# Altium schematic sheet Embedded_Circuits.SchDoc
size A
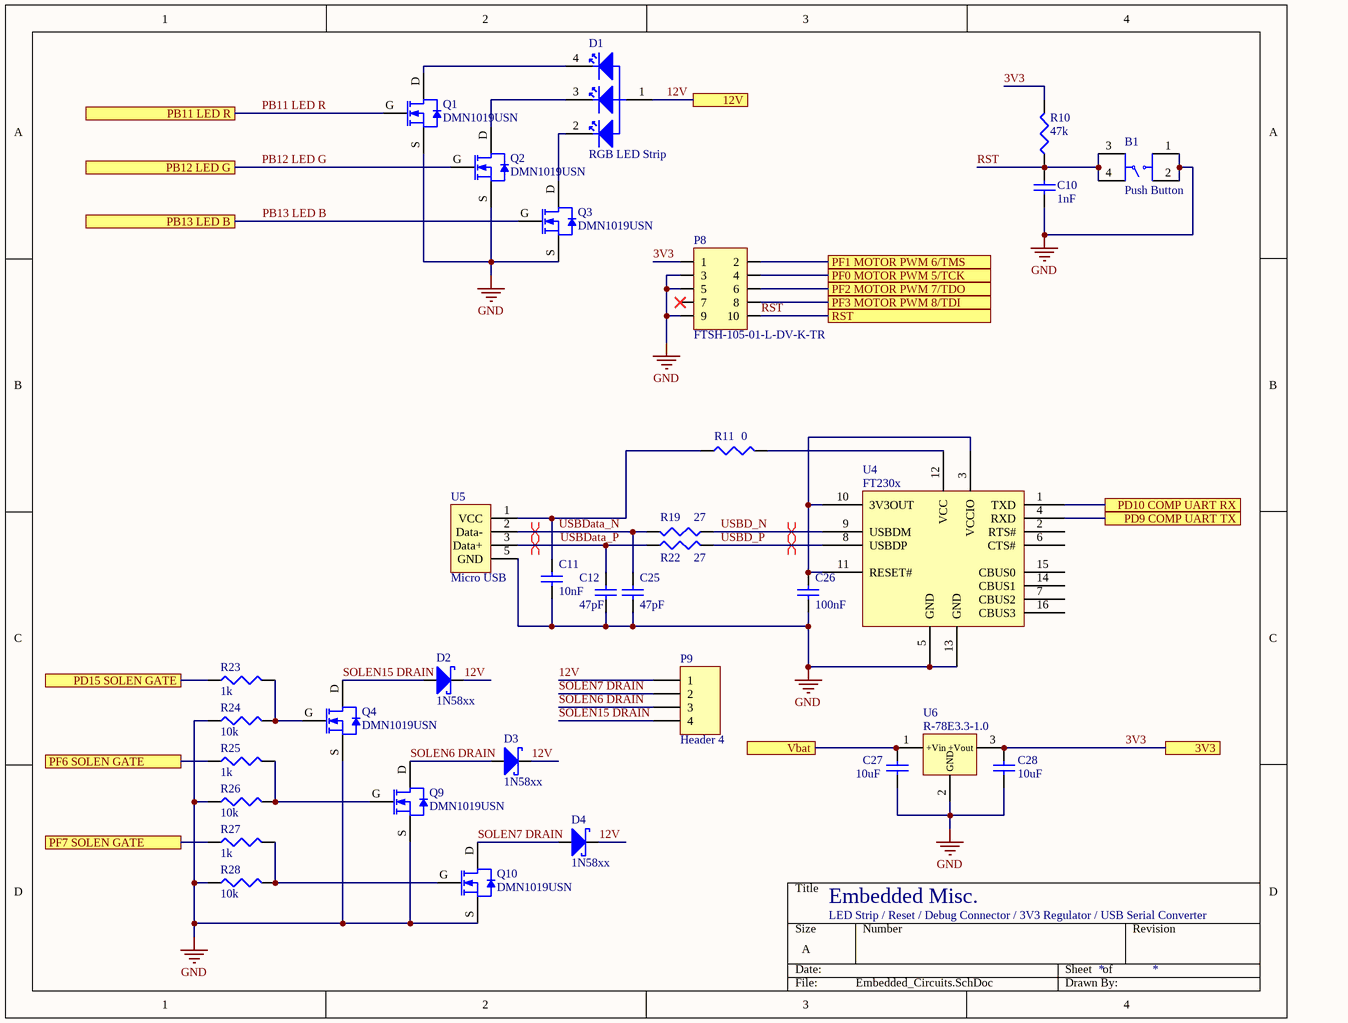
[diagram p0: Embedded_Circuits.SchDoc]

## Parts
B1  Push Button  [Push Button]
C10  value 1nF  [C1206]  (hidden comment: Cap Semi)
C11  value 10nF  [C1206]  (hidden comment: Cap)
C12  value 47pF  [C1206]  (hidden comment: Cap)
C25  value 47pF  [C1206]  (hidden comment: Cap)
C26  value 100nF  [C1206]  (hidden comment: Cap)
C27  value 10uF  [C1206]  (hidden comment: Cap)
C28  value 10uF  [C1206]  (hidden comment: Cap)
D1  RGB LED Strip  [Header 1x4]
D2  1N58xx  [1N58xx]
D3  1N58xx  [1N58xx]
D4  1N58xx  [1N58xx]
P8  FTSH-105-01-L-DV-K-TR  [FTSH-105-01-L-DV-K-TR]
P9  Header 4  [HDR1X4]
Q1  DMN1019USN  [SOT-23]
Q2  DMN1019USN  [SOT-23]
Q3  DMN1019USN  [SOT-23]
Q4  DMN1019USN  [SOT-23]
Q9  DMN1019USN  [SOT-23]
Q10  DMN1019USN  [SOT-23]
R10  value 47k  [J1-0603]  (hidden comment: Res3)
R11  value 0  [J1-0603]  (hidden comment: Res3)
R19  value 27  [J1-0603]  (hidden comment: Res3)
R22  value 27  [J1-0603]  (hidden comment: Res3)
R23  value 1k  [J1-0603]  (hidden comment: Res3)
R24  value 10k  [J1-0603]  (hidden comment: Res3)
R25  value 1k  [J1-0603]  (hidden comment: Res3)
R26  value 10k  [J1-0603]  (hidden comment: Res3)
R27  value 1k  [J1-0603]  (hidden comment: Res3)
R28  value 10k  [J1-0603]  (hidden comment: Res3)
U4  FT230x  [FT230X]
U5  Micro USB  [Micro USB]
U6  R-78E3.3-1.0  [R-78Exx-1.0]

## Ports
3V3, 12V, PB11 LED R, PB12 LED G, PB13 LED B, PD9 COMP UART TX, PD10 COMP UART RX, PD15 SOLEN GATE, PF0 MOTOR PWM 5/TCK, PF1 MOTOR PWM 6/TMS, PF2 MOTOR PWM 7/TDO, PF3 MOTOR PWM 8/TDI, PF6 SOLEN GATE, PF7 SOLEN GATE, RST, Vbat

## Nets
GND: B1.1 B1.2 C10.1 C11.1 C12.1 C25.1 C26.1 C27.1 C28.1 P8.3 P8.5 P8.9 Q1.S Q2.S Q3.S Q4.S Q9.S Q10.S R24.1 R26.1 R28.1 U4.5(GND) U4.13(GND) U5.5(GND) U6.2(GND)
3V3: C28.2 P8.1 R10.2 U6.3(+Vout) ; port 3V3
12V: D1.1 D2.K(Cathode) D3.K(Cathode) D4.K(Cathode) P9.1 ; port 12V
PB11 LED R: Q1.G ; port PB11 LED R
PB12 LED G: Q2.G ; port PB12 LED G
PB13 LED B: Q3.G ; port PB13 LED B
PD9 COMP UART TX: U4.4(RXD) ; port PD9 COMP UART TX
PD10 COMP UART RX: U4.1(TXD) ; port PD10 COMP UART RX
PD15 SOLEN GATE: R23.1 ; port PD15 SOLEN GATE
PF0 MOTOR PWM 5/TCK: P8.4 ; port PF0 MOTOR PWM 5/TCK
PF1 MOTOR PWM 6/TMS: P8.2 ; port PF1 MOTOR PWM 6/TMS
PF2 MOTOR PWM 7/TDO: P8.6 ; port PF2 MOTOR PWM 7/TDO
PF3 MOTOR PWM 8/TDI: P8.8 ; port PF3 MOTOR PWM 8/TDI
PF6 SOLEN GATE: R25.1 ; port PF6 SOLEN GATE
PF7 SOLEN GATE: R27.1 ; port PF7 SOLEN GATE
RST: B1.3 B1.4 C10.2 P8.10 R10.1 ; port RST
SOLEN6 DRAIN: D3.A(Anode) P9.3 Q9.D
SOLEN7 DRAIN: D4.A(Anode) P9.2 Q10.D
SOLEN15 DRAIN: D2.A(Anode) P9.4 Q4.D
USBD_N: R19.1 U4.9(USBDM)
USBD_P: R22.2 U4.8(USBDP)
USBData_N: C25.2 R19.2 U5.2(Data-)
USBData_P: C12.2 R22.1 U5.3(Data+)
Vbat: C27.2 U6.1(+Vin) ; port Vbat
NetC11_2: C11.2 R11.1 U5.1(VCC)
NetC26_2: C26.2 U4.3(VCCIO) U4.10(3V3OUT) U4.11(RESET#)
NetD1_2: D1.2 Q3.D
NetD1_3: D1.3 Q2.D
NetD1_4: D1.4 Q1.D
NetQ4_G: Q4.G R23.2 R24.2
NetQ9_G: Q9.G R25.2 R26.2
NetQ10_G: Q10.G R27.2 R28.2
NetR11_2: R11.2 U4.12(VCC)

Not connected (* = marked no-connect by the designer): P8 7*; U4 2(RTS#) 6(CTS#) 7(CBUS2) 14(CBUS1) 15(CBUS0) 16(CBUS3)

## Layout directives
differential pair: USBD_N, USBD_P, USBData_N, USBData_P

## Notes on the sheet
- Embedded Misc.
- LED Strip / Reset / Debug Connector / 3V3 Regulator / USB Serial Converter

## Library data of the parts
B1 = Push Button: Tactile Switch SPST-NO Top Actuated Through Hole; Digikey Link: https://www.digikey.com/product-detail/en/te-connectivity-alcoswitch-switches/FSM101/450-1157-ND/701084; Drawing: https://www.te.com/commerce/DocumentDelivery/DDEController?Action=srchrtrv&DocNm=1571140&DocType=Customer+Drawing&DocLang=English
C10 = Cap Semi: Capacitor (Semiconductor SIM Model); Published: 8-Jun-2000; LatestRevisionDate: 29-May-2009; LatestRevisionNote: IPC-7351 Footprint Added.; PackageReference: C1206; Publisher: Altium Limited; PackageDescription: Chip Capacitor; Supplier 1: Digi-Key; Supplier Part Number 1: 490-4761-1-ND
C11 C12 C25-C28 = Cap: Capacitor; Published: 8-Jun-2000; LatestRevisionDate: 17-Jul-2002; LatestRevisionNote: Re-released for DXP Platform.; PackageReference: RAD-0.3; Publisher: Altium Limited; PackageDescription: Radial Cap, Thru-Hole; 2 Leads; 0.3 in Pin Spacing; Supplier 1: Digi-Key
  C11: Supplier Part Number 1: 1276-1921-1-ND
  C12 C25: Supplier Part Number 1: 490-16375-1-ND
  C26: Supplier Part Number 1: 1276-1001-1-ND
  C27 C28: Supplier Part Number 1: 1276-2872-1-ND
D1 = RGB LED Strip: LED RGB Strip - Bare Nonaddressable; Sparkfun Link: https://www.sparkfun.com/products/12021
D2-D4 = 1N58xx: 1A Schottky Barrier Rectifier Diode; Datasheet: http://www.kesenes.com/pdf/1n5817-1n5819.pdf; Digikey: https://www.digikey.com/product-detail/en/comchip-technology/SS24-HF/641-SS24-HFCT-ND/10443817
P8 = JTAG Header: CONN HEADER 10POS DUAL .05" SMD; Digikey Link: https://www.digikey.com/product-detail/en/samtec-inc/FTSH-105-01-L-DV-K-TR/SAM13165CT-ND/8827920; Drawings: http://suddendocs.samtec.com/prints/ftsh-1xx-xx-xxx-dv-xxx-xxx-mkt.pdf; Datasheet: http://suddendocs.samtec.com/catalog_english/ftsh_smt.pdf
P9 = Header 4: Header, 4-Pin; LatestRevisionDate: 17-Jul-2002; LatestRevisionNote: Re-released for DXP Platform.; Publisher: Altium Limited
Q1-Q4 Q9 Q10 = DMN1019USN: 12V N-Channel Enhancement Mode MOSFET; Datasheet: https://www.diodes.com/assets/Datasheets/DMN1019USN.pdf; Digikey: https://www.digikey.com/product-detail/en/diodes-incorporated/DMN1019USN-13/DMN1019USN-13DICT-ND/4898885
R10 R11 R19 R22-R28 = Res3: Resistor; Published: 8-Jun-2000; LatestRevisionDate: 29-May-2009; LatestRevisionNote: IPC-7351 Footprint Added.; PackageReference: J1-0603; Publisher: Altium Limited; PackageDescription: Chip Resistor
U4 = FTDI FT230x: USB to Basic UART IC; Datasheet: https://www.ftdichip.com/Support/Documents/DataSheets/ICs/DS_FT230X.pdf
U5 = Micro USB: USB - micro B USB 2.0 Receptacle Connector 5 Position Surface Mount, Right Angle; Digikey: https://www.digikey.com/product-detail/en/molex-llc/1050170001/WM1399CT-ND/2350885; Datasheet: https://www.molex.com/pdm_docs/sd/1050170001_sd.pdf
U6 = R-78Exx-1.0: 1A DC/DC Voltage Converter; Datasheet: https://www.recom-power.com/pdf/Innoline/R-78Exx-0.5.pdf